# Altium schematic sheet StepperMotorDriver.SchDoc
size A4
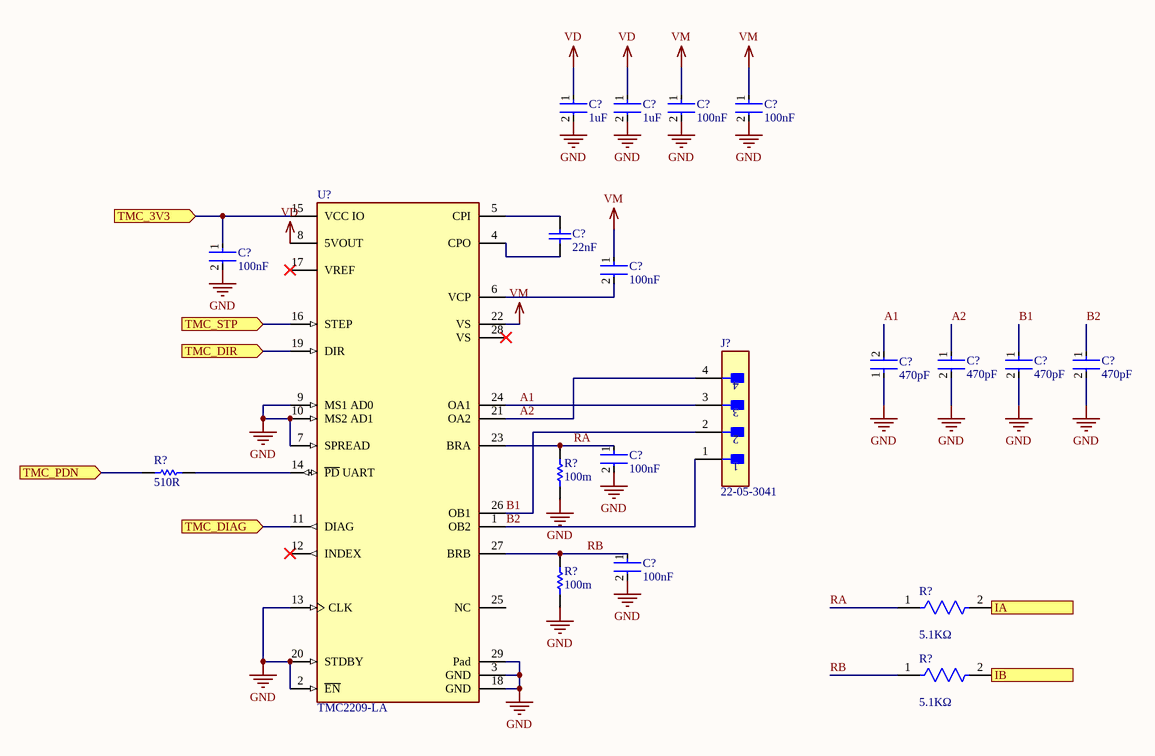
[diagram p0: StepperMotorDriver.SchDoc]

## Parts
(Parts that share a designator on the sheet are numbered #1, #2 ... from top to bottom, then left to right.)
C?#1  Capacitance: 1uF  [FP-GRM55D-0_4-IPC_A]  (hidden comment: GRM55DR72E105KW01L)
C?#2  Capacitance: 1uF  [FP-GRM55D-0_4-IPC_A]  (hidden comment: GRM55DR72E105KW01L)
C?#3  Capacitance: 100nF  [FP-1206-L_3_2_0_2-W_1_6_0-MFG]  (hidden comment: 12061C104KAZ2A)
C?#4  Capacitance: 100nF  [FP-1206-L_3_2_0_2-W_1_6_0-MFG]  (hidden comment: 12061C104KAZ2A)
C?#5  Capacitance: 100nF  [FP-1206-L_3_2_0_2-W_1_6_0-MFG]  (hidden comment: 12061C104KAZ2A)
C?#6  Capacitance: 22nF  [WCAP-CSGP_0402_L1W0.5H0.5]  (hidden comment: 885012205033)
C?#7  Capacitance: 100nF  [FP-1206-L_3_2_0_2-W_1_6_0-MFG]  (hidden comment: 12061C104KAZ2A)
C?#8  Capacitance: 470pF  [FP-GRM155-0_05-IPC_A]  (hidden comment: GRM1555C1H471JA01D)
C?#9  Capacitance: 470pF  [FP-GRM155-0_05-IPC_A]  (hidden comment: GRM1555C1H471JA01D)
C?#10  Capacitance: 470pF  [FP-GRM155-0_05-IPC_A]  (hidden comment: GRM1555C1H471JA01D)
C?#11  Capacitance: 470pF  [FP-GRM155-0_05-IPC_A]  (hidden comment: GRM1555C1H471JA01D)
C?#12  Capacitance: 100nF  [FP-1206-L_3_2_0_2-W_1_6_0-MFG]  (hidden comment: 12061C104KAZ2A)
C?#13  Capacitance: 100nF  [FP-1206-L_3_2_0_2-W_1_6_0-MFG]  (hidden comment: 12061C104KAZ2A)
J?  22-05-3041  [FP-22-05-3041-MFG]
R?#1  Resistance: 510R  [RESC1608X55X30NL15T15]  (hidden comment: ERJ3EKF5100V)
R?#2  100m  [RESC1005X40X27LL10T10]
R?#3  100m  [RESC1005X40X27LL10T10]
R?#4  Resistance: 5.1KΩ  [FP-RT0603-MFG]  (hidden comment: RT0603FRE075K1L)
R?#5  Resistance: 5.1KΩ  [FP-RT0603-MFG]  (hidden comment: RT0603FRE075K1L)
U?  TMC2209-LA  [FP-TMC2209-LA-IPC_C]

## Ports
IA (in), IB (in), TMC_3V3 (in), TMC_DIAG (in), TMC_DIR (in), TMC_PDN (in), TMC_STP (in)

## Nets
GND: C?#1.2 C?#2.2 C?#3.2 C?#4.2 C?#5.2 C?#8.2 C?#9.2 C?#10.2 C?#11.1 C?#12.2 C?#13.2 R?#2.1 R?#3.1 U?.2(~{EN}) U?.3(GND) U?.7(SPREAD) U?.9(MS1_AD0) U?.10(MS2_AD1) U?.13(CLK) U?.18(GND) U?.20(STDBY) U?.29(Pad)
VD: C?#1.1 C?#2.1 U?.8(5VOUT)
VM: C?#3.1 C?#4.1 C?#7.1 U?.22(VS)
A1: C?#11.2 J?.3 U?.24(OA1)
A2: C?#8.1 J?.4 U?.21(OA2)
B1: C?#9.1 J?.2 U?.26(OB1)
B2: C?#10.1 J?.1 U?.1(OB2)
IA: R?#4.2 ; port IA
IB: R?#5.2 ; port IB
RA: C?#12.1 R?#2.2 R?#4.1 U?.23(BRA)
RB: C?#13.1 R?#3.2 R?#5.1 U?.27(BRB)
TMC_3V3: C?#5.1 U?.15(VCC_IO) ; port TMC_3V3
TMC_DIAG: U?.11(DIAG) ; port TMC_DIAG
TMC_DIR: U?.19(DIR) ; port TMC_DIR
TMC_PDN: R?#1.1 ; port TMC_PDN
TMC_STP: U?.16(STEP) ; port TMC_STP
NetC?#6_1: C?#6.1 U?.4(CPO)
NetC?#6_2: C?#6.2 U?.5(CPI)
NetC?#7_2: C?#7.2 U?.6(VCP)
NetR?#1_2: R?#1.2 U?.14(~{PD}_UART)

Not connected (* = marked no-connect by the designer): U? 12(INDEX)* 17(VREF)* 25(NC) 28(VS)*

## Library data of the parts
C?#1 C?#2 = CMP-2000-06370-2: Chip Multilayer Ceramic Capacitors for General Purpose, 2220, 1.0uF, X7R, 15%, 10%, 250V; Width: 5mm; Height: 2mm; Case Code (Imperial): 2220; Voltage Rating (DC): 250V; Max Operating Temperature: 125°C; Number of Pins: 2; Min Operating Temperature: -55°C; Termination: SMD/SMT; Case/Package: 2220; Dielectric: X7R; Material: Ceramic; REACH SVHC: No SVHC; Voltage: 250V; Packaging: Tape and Reel; Thickness: 0.087inch; Depth: 5mm; Package Quantity: 1; Tolerance: 10%; Mount: Surface Mount; Voltage Rating: 250V; Length: 5.7mm; Case Code (Metric): 5750; Lead Free: Lead Free
C?#3-C?#5 C?#7 C?#12 C?#13 = CMP-04427-004798-1: General Purpose Ceramic Capacitor, 1206, 100nF, 10%, X7R, 15%, 100V; Features: Soft Termination; Termination: SMD/SMT; Mount: Surface Mount; Tolerance: 10%; Voltage Rating: 100V; Length: 3.2mm; Case/Package: 1206; Case Code (Metric): 3216; RoHS Compliant: Yes; Package Quantity: 1; Max Operating Temperature: 125°C; Voltage Rating (DC): 100V; Min Operating Temperature: -55°C; Number of Pins: 2; Packaging: Tape and Reel; Width: 0.063inch; REACH SVHC: No SVHC; Lead Free: Lead Free; Construction: Flat; Radiation Hardening: No; Case Code (Imperial): 1206; Thickness: 0.05inch; Series: FLEXITERM®; Depth: 1.6mm; Dielectric: X7R
C?#6 = CMP-03913-53703171-1: 885012205033 Ceramic Capacitor 22nF, 16VDC, 0402, ±10 %; Voltage Rating: 16V; Tolerance: 10%; Insulation Resistance: 10GΩ; NexarPartId: 53703171; Case Code (Imperial): 0402; Case Code (Metric): 1005; Mount: Surface Mount; Case/Package: 0402; Min Operating Temperature: -55°C; Height: 500µm; RoHS: Compliant; Packaging: Tape & Reel (TR); Length: 1mm; Thickness: 558.8µm; Max Operating Temperature: 125°C; Width: 500µm
C?#8-C?#11 = CMP-2008-04369-2: Chip Multilayer Ceramic Capacitors for General Purpose, 0402, 470pF, C0G, 30ppm/°C, 5%, 50V; Insulation Resistance: 10GR; Depth: 0.5mm; Voltage Rating: 50V; Packaging: Tape and Reel; Material: Ceramic; Lead Free: Lead Free; Max Operating Temperature: 125°C; Length: 1mm; Min Operating Temperature: -55°C; Height: 0.5mm; Width: 0.5mm; Thickness: 0.022inch; Voltage: 50V; Termination: SMD/SMT; Dielectric Material: Ceramic; REACH SVHC: No SVHC; Voltage Rating (DC): 50V; Package Quantity: 1; Dielectric: C0G; Radiation Hardening: No; Mount: Surface Mount; Case/Package: 0402; Number of Pins: 2; Tolerance: 5%; Temperature Coefficient: 30ppm/°C; Case Code (Metric): 1005; Case Code (Imperial): 0402
J? = CMP-2000-05533-2: CONN HEADER R/A 4POS 2.54MM; Manufacturer: Molex; Current Rating: 4A; Description: Connector Header Through Hole, Right Angle 4 position 0.100" (2.54mm); Conn Gender: Male; Number Of Contacts: 4; Conn Orientation: Right Angle; Voltage Rating: 500V; Number Of Rows: 1; Contact Material: Tin,Nickel; Temperature Range Low: -40°C; ComponentLink2Description: Datasheet; Automotive: No; Lead Free: Yes; ComponentLink2URL: https://www.molex.com/webdocs/datasheets/pdf/en-us/0022053041_PCB_HEADERS.pdf; Octopart: https://octopart.com/22-05-3041-molex-2579; Temperature: -40°C to +80°C; Height: 6.6mm; Device Class L3: unset; Temperature Range High: +80°C; Pitch: 2.54mm; Manufacturer Part Number: 22-05-3041; Device Class L2: Headers and Wire Housings; RoHS: TRUE; Footprint Url: https://www.molex.com/pdm_docs/sd/022053041_sd.pdf; Category: Conn; Digikey Description: CONN HEADER R/A 4POS 2.54MM; Device Class L1: Connectors; Package: 0
R?#1 = CMP-2000-00539-1: Manufacturer: Panasonic; Part Number: ERJ3EKF5100V
R?#2 R?#3 = CMP-2002-04635-1: Part Number: ERJ-2BSFR10X; Manufacturer: Panasonic
R?#4 R?#5 = CMP-2000-04778-2: RES SMD 5.1K OHM 1% 1/10W 0603; Manufacturer: Yageo; Value: 5.1KΩ; Temperature Coefficient: 50 ppm/°C; Power Rating: 0.1W; Voltage Rating: 75V; Description: RT0603 5.1KΩ 0.1W 50 ppm/°C 1.00%; Tolerance: 0.01; Lead Free: Yes; Temperature Range High: +155°C; Package: RT0603; Series: RT; Footprint Url: http://www.yageo.com/exep/pages/download/literatures/PYu-R_Mount_10.pdf; Ipc Land Pattern Name: RESC16080X45; Mouser Description: Res Thin Film 0603 5.1K Ohm 1% 0.1W(1/10W) ±50ppm/C Epoxy Pad SMD T/R; Octopart: https://octopart.com/rt0603fre075k1l-yageo-1421390; ComponentLink2URL: http://www.yageo.com/documents/recent/PYu-RT_1-to-0.01_RoHS_L_9.pdf; Manufacturer Part Number: RT0603FRE075K1L; RoHS: TRUE; Device Class L3: Chip SMD Resistors; Digikey Description: RES SMD 5.1K OHM 1% 1/10W 0603; Temperature: -55°C to +155°C; Height: 0.55mm; Automotive: No; Device Class L1: Passive Components; Temperature Range Low: -55°C; Category: Res; Composition: Thin Film; ComponentLink2Description: Datasheet; Device Class L2: Resistors
U? = CMP-237673-000004-1: Bipolar Motor Driver Power MOSFET Step/Direction, UART 28-QFN (5x5); Manufacturer: Trinamic; Nominal Supply Current: 7-7.5mA; Max Supply Voltage: 29V; Output Current: 2.8A; Standoff Height: 0mm; Motor Type: Stepper; Max Junction Temp: +125°C; Max Power Dissipation: 2.8W; Min Supply Voltage: 1.5V; Number Of Outputs: 1; RoHS: TRUE; ComponentLink2Description: Datasheet; Temperature: -40°C to +125°C; Ipc Land Pattern Name: QFN50P500X500X85-28; Lead Free: Yes; Device Class L1: Integrated Circuits (ICs); ComponentLink2URL: https://www.trinamic.com/fileadmin/assets/Products/ICs_Documents/TMC2209_Datasheet_V103.pdf; Device Class L2: Power Management ICs; Temperature Range Low: -40°C; Automotive: No; Manufacturer Part Number: TMC2209-LA; Category: IC; Height: 0.9mm; Package: 0; Device Class L3: Motor Drivers; Octopart: https://octopart.com/tmc2209-la-trinamic-105993617; Temperature Range High: +125°C